# Altium schematic sheet indicator.SchDoc
size A4
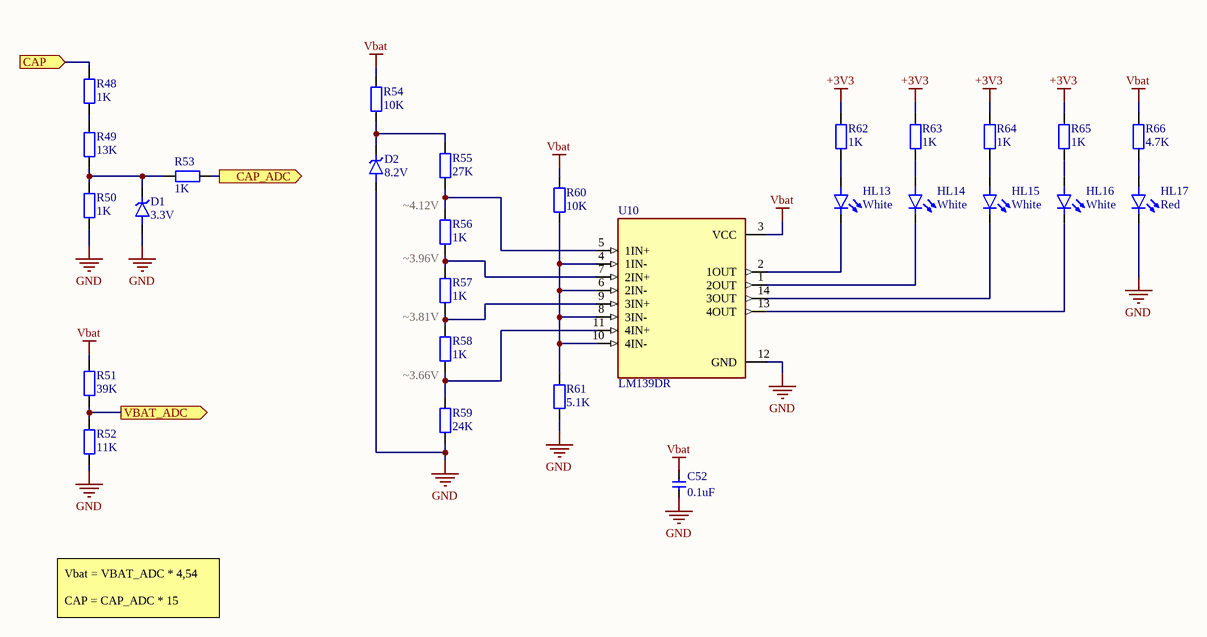
[diagram p0: indicator.SchDoc]

## Parts
C52  0.1uF  [CAP0805]
D1  3.3V  [SOD-80]
D2  8.2V  [SOD-80]
HL13  White  [LED0603_GREEN]
HL14  White  [LED0603_GREEN]
HL15  White  [LED0603_GREEN]
HL16  White  [LED0603_GREEN]
HL17  Red  [LED0603_RED]
R48  1K  [RES0805]
R49  13K  [RES0805]
R50  1K  [RES0805]
R51  39K  [RES0805]
R52  11K  [RES0805]
R53  1K  [RES0805]
R54  10K  [RES0805]
R55  27K  [RES0805]
R56  1K  [RES0805]
R57  1K  [RES0805]
R58  1K  [RES0805]
R59  24K  [RES0805]
R60  10K  [RES0805]
R61  5.1K  [RES0805]
R62  1K  [RES0805]
R63  1K  [RES0805]
R64  1K  [RES0805]
R65  1K  [RES0805]
R66  4.7K  [RES0805]
U10  LM139DR  [SOIC-14]

## Ports
CAP (in), CAP_ADC (out), VBAT_ADC (out)

## Nets
+3V3: R62.2 R63.2 R64.2 R65.2
GND: C52.1 D1.A D2.A HL17.1(K) R50.1 R52.1 R59.1 R61.1 U10.12(GND)
Vbat: C52.2 R51.2 R54.2 R60.2 R66.2 U10.3(VCC)
CAP: R48.2 ; port CAP
CAP_ADC: R53.1 ; port CAP_ADC
VBAT_ADC: R51.1 R52.2 ; port VBAT_ADC
NetD1_K: D1.K R49.1 R50.2 R53.2
NetD2_K: D2.K R54.1 R55.2
NetHL13_1: HL13.1(K) U10.2(1OUT)
NetHL13_2: HL13.2(A) R62.1
NetHL14_1: HL14.1(K) U10.1(2OUT)
NetHL14_2: HL14.2(A) R63.1
NetHL15_1: HL15.1(K) U10.14(3OUT)
NetHL15_2: HL15.2(A) R64.1
NetHL16_1: HL16.1(K) U10.13(4OUT)
NetHL16_2: HL16.2(A) R65.1
NetHL17_2: HL17.2(A) R66.1
NetR48_1: R48.1 R49.2
NetR55_1: R55.1 R56.2 U10.5(1IN+)
NetR56_1: R56.1 R57.2 U10.7(2IN+)
NetR57_1: R57.1 R58.2 U10.9(3IN+)
NetR58_1: R58.1 R59.2 U10.11(4IN+)
NetR60_1: R60.1 R61.2 U10.4(1IN-) U10.6(2IN-) U10.8(3IN-) U10.10(4IN-)

## Notes on the sheet
- (near R56) ~4.12V
- ~3.96V
- ~3.81V
- (near R58) ~3.66V
- Vbat = VBAT_ADC * 4,54
  CAP = CAP_ADC * 15

## Library data of the parts
C52 = CAP Ceramic: Ceramic SMD Cap
D1 D2 = Diode Zener: Zener Diode / BZV55C8V2
HL13-HL17 = LED: LED smd
R48-R66 = RES: RES smd
U10 = LM139DR: Quad differential comparator; ComponentLink1Description: Chipdip; ComponentLink1URL: https://www.chipdip.ru/product0/8013766664